# EAGLE schematic plantHAT (EAGLE 8.1.1)
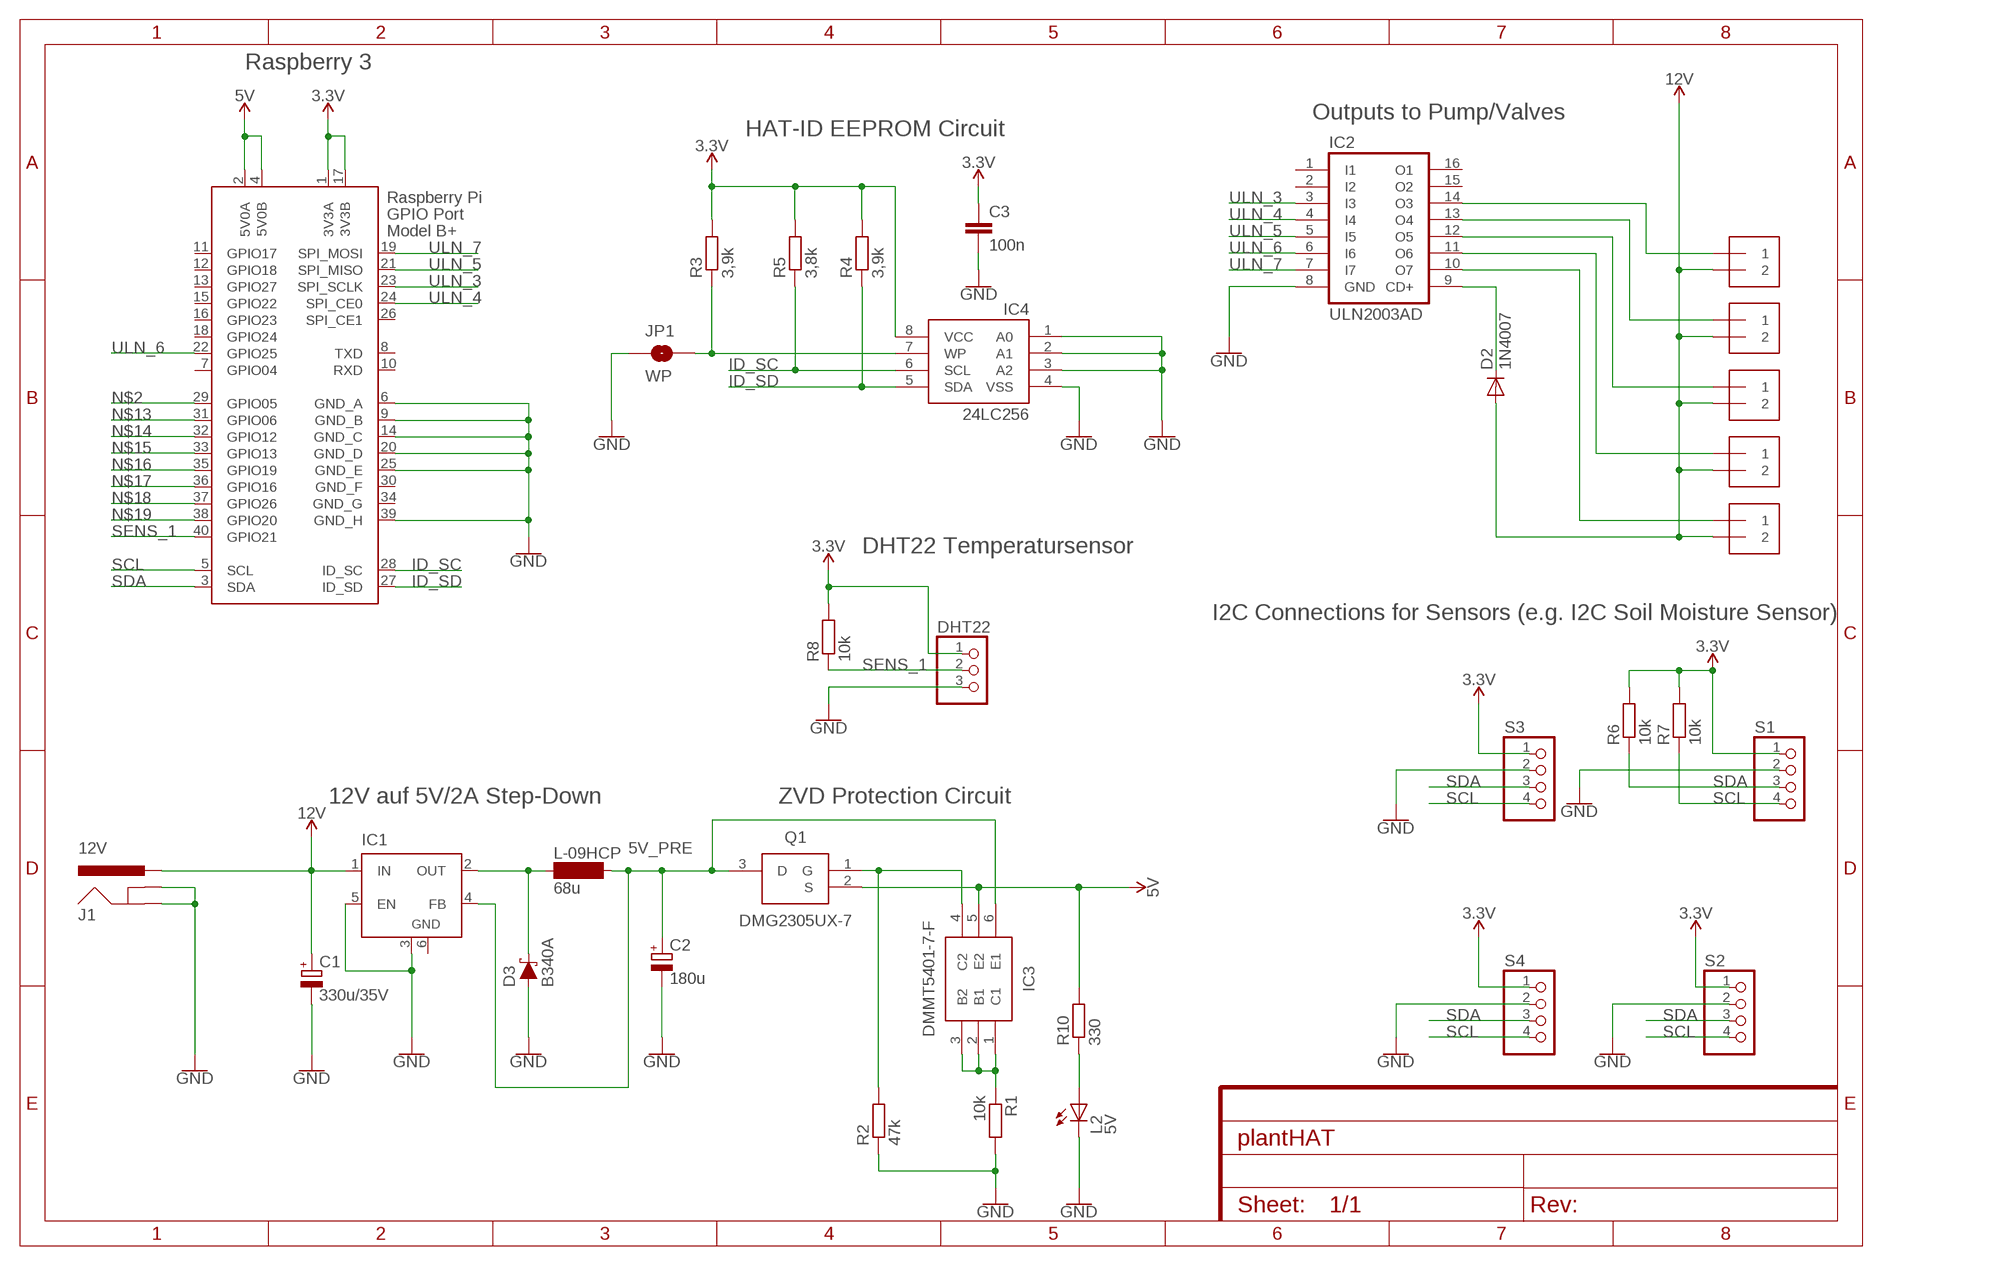
[diagram p0: schematic, sheet 1]
FRAME1 (FRAME-A4L): CNAME: plantHead Raspberry HAT; CREVISION: 1.0; DESIGNER: Patrick Laza

## Parts
C1  330u/35V  CPOL-EUE5-10.5  [E5-10,5]
C2  180u  CPOL-EUE5-10.5  [E5-10,5]
C3  100n  C-EU025-025X050  [C025-025X050]
D2  1N4007  1N4004  [DO41-10]
D3  B340A  DIODE-SCHOTTKY-B340A  [SMA-DIODE]
DHT22  PINHD-1X3  [1X03]
IC1  LM2596S  [TO263-5]
IC2  ULN2003AD  [SO16]
IC3  DMMT5401-7-F  [SOT95P275X110-6N]
IC4  24LC256  EEPROM-I2CSMD  [SO08]
J1  12V  POWER_JACK  [POWER_JACK_PTH]
J2  1X2-3.5MM  [1X2-3.5MM]
J3  1X2-3.5MM  [1X2-3.5MM]
J4  1X2-3.5MM  [1X2-3.5MM]
J5  1X2-3.5MM  [1X2-3.5MM]
J6  1X2-3.5MM  [1X2-3.5MM]
JP1  WP  JUMPER-SMT_2_NO_SILK  [SMT-JUMPER_2_NO_SILK]
L2  5V  LEDCHIP-LED0805  [CHIP-LED0805]
L-09HCP  68u  SD12-680  [SD12-680]
Q1  DMG2305UX-7  [SOT96P240X100-3N]
R1  10k  R-EU_R0805  [R0805]
R2  47k  R-EU_R0805  [R0805]
R3  3,9k  R-EU_R0805  [R0805]
R4  3,9k  R-EU_R0805  [R0805]
R5  3,8k  R-EU_R0805  [R0805]
R6  10k  R-EU_R0805  [R0805]
R7  10k  R-EU_R0805  [R0805]
R8  10k  R-EU_R0805  [R0805]
R10  330  R-EU_R0805  [R0805]
S1  PINHD-1X4  [1X04]
S2  PINHD-1X4  [1X04]
S3  PINHD-1X4  [1X04]
S4  PINHD-1X4  [1X04]
X2  RASPI_BOARD_B+#_HDC  [RASPI_BOARD_B+HAT_DF_CF]

## Nets
3.3V: C3.1 DHT22.1 IC4.8(VCC) R3.2 R4.2 R5.2 R6.2 R7.2 R8.2 S1.1 S2.1 S3.1 S4.1 X2.1(3V3A) X2.17(3V3B)
5V: IC3.5(E2) Q1.2(S) R10.2 X2.2(5V0A) X2.4(5V0B)
5V_PRE: C2.+ IC1.4(FB) IC3.6(E1) L-09HCP.2 Q1.3(D)
12V: C1.+ D2.A IC1.1(IN) J1.PWR J2.2 J3.2 J4.2 J5.2 J6.2
GND: C1.- C2.- C3.2 D3.A DHT22.3 IC1.3(GND) IC1.5(EN) IC2.8(GND) IC4.1(A0) IC4.2(A1) IC4.3(A2) IC4.4(VSS) J1.GND J1.GNDBREAK JP1.1 L2.C R1.2 R2.1 S1.2 S2.2 S3.2 S4.2 X2.6(GND_A) X2.9(GND_B) X2.14(GND_C) X2.20(GND_D) X2.25(GND_E) X2.39(GND_H)
ID_SC: IC4.6(SCL) R5.1 X2.28(ID_SC)
ID_SD: IC4.5(SDA) R4.1 X2.27(ID_SD)
N$1: D3.C IC1.2(OUT) L-09HCP.1
N$2: X2.29(GPIO05)
N$4: IC2.14(O3) J6.1
N$5: IC2.13(O4) J5.1
N$6: IC2.12(O5) J4.1
N$7: IC2.11(O6) J3.1
N$8: IC2.10(O7) J2.1
N$9: IC3.1(C1) IC3.2(B1) IC3.3(B2) R1.1
N$10: IC3.4(C2) Q1.1(G) R2.2
N$11: IC4.7(WP) JP1.2 R3.1
N$13: X2.31(GPIO06)
N$14: X2.32(GPIO12)
N$15: X2.33(GPIO13)
N$16: X2.35(GPIO19)
N$17: X2.36(GPIO16)
N$18: X2.37(GPIO26)
N$19: X2.38(GPIO20)
N$20: L2.A R10.1
N$21: D2.C IC2.9(CD+)
SCL: R7.1 S1.4 S2.4 S3.4 S4.4 X2.5(SCL)
SDA: R6.1 S1.3 S2.3 S3.3 S4.3 X2.3(SDA)
SENS_1: DHT22.2 R8.1 X2.40(GPIO21)
ULN_3: IC2.3(I3) X2.23(SPI_SCLK)
ULN_4: IC2.4(I4) X2.24(SPI_CE0)
ULN_5: IC2.5(I5) X2.21(SPI_MISO)
ULN_6: IC2.6(I6) X2.22(GPIO25)
ULN_7: IC2.7(I7) X2.19(SPI_MOSI)
Unconnected: IC2.1(I1) IC2.2(I2) IC2.15(O2) IC2.16(O1) X2.7(GPIO04) X2.8(TXD) X2.10(RXD) X2.11(GPIO17) X2.12(GPIO18) X2.13(GPIO27) X2.15(GPIO22) X2.16(GPIO23) X2.18(GPIO24) X2.26(SPI_CE1)

## Notes on the sheet
- Raspberry 3
- Outputs to Pump/Valves
- HAT-ID EEPROM Circuit
- DHT22 Temperatursensor
- I2C Connections for Sensors (e.g. I2C Soil Moisture Sensor)
- 12V auf 5V/2A Step-Down | ZVD Protection Circuit

## Power pins joined to a net without a drawn wire
GND: IC1.6(GND)
GND_F: X2.30(GND_F)
GND_G: X2.34(GND_G)

## Library data of the parts
C1 C2 = resistor:CPOL-EU: POLARIZED CAPACITOR, European symbol
C3 = resistor:C-EU: CAPACITOR, European symbol
D2 = diode:1N4004: DIODE general purpose rectifier, 1 A
D3 = SparkFun-DiscreteSemi:DIODE-SCHOTTKY: Schottky diode A Schottky diode is a semiconductor diode which has a low forward voltage drop and a very fast switching action.; PROD_ID: DIO-09886; VALUE: 3A/40V/500mV
DHT22 = pinhead:PINHD-1X3: PIN HEADER
IC1 = linear:LM2596S: STEP-DOWN VOLTAGE REGULATOR
IC2 = uln-udn:ULN2003A: DRIVER ARRAY
IC3 = plantHead:DMMT5401-7-F: Transistor Dual PNP 150V 0.2A SOT26-6 Diodes Inc DMMT5401-7-F Dual PNP Bipolar Transistor, -200 mA, -150 V, 6-Pin SOT-26 <https://componentsearchengine.com/Images/3/DMMT5401-7-F.jpg> Source: Datasheet <http://docs-europe.electrocomponents.com/webdocs/0e49/0900766b80e49504.pdf>; DESCRIPTION: Transistor Dual PNP 150V 0.2A SOT26-6 Diodes Inc DMMT5401-7-F Dual PNP Bipolar Transistor, -200 mA, -150 V, 6-Pin SOT-26; HEIGHT: 1.1mm; MANUFACTURER_NAME: Diodes Inc.; MANUFACTURER_PART_NUMBER: DMMT5401-7-F; RS_PART_NUMBER: 1220640; SUPPLIER_NAME: RS
IC4 = SparkFun-IC-Memory:EEPROM-I2C: I2C EEPROMs, 24LC256 and others 24LC256 Series 256 kb I2C 2 Wire (32 k x 8 Bit) 2.5 V Serial EEPROM SMD - SOIC-8 Datasheet SparkFun Products SparkFun UDB5 - PIC UAV Development Board <https://www.sparkfun.com/products/11703> (GPS-11703); PROD_ID: IC-09714
J1 = SparkFun-Connectors:POWER_JACK: Power Jack Connector This is the standard 5.5mm barrel jack for power. The PTH is the most common, proven, reliable, footprint. The Slot footprint only works if the mill layer is transmitted to the PCB fab house so be warned. Here are the connectors we sell at SparkFun: DC Barrel Power Jack/Connector <https://www.sparkfun.com/products/119> (PRT-00119) DC Barrel Power Jack/Connector (SMD) <https://www.sparkfun.com/products/12748> (PRT-12748) DC Barrel Jack Adapter - Breadboard Compatible <https://www.sparkfun.com/products/10811> (PRT-10811) It is used on this SparkFun product (and many, many others): SparkFun RedBoard - Programmed with Arduino <https://www.sparkfun.com/products/12757> (DEV-12757) Also, if you need a mating power supply or connector, please check these out: Wall Adapter Power Supply - 9VDC 650mA <https://www.sparkfun.com/products/298> (TOL-00298) DC Barrel Jack Adapter - Male <https://www.sparkfun.com/products/10287> (PRT-10287); PROD_ID: CONN-08197
J2-J6 = adafruit:1X2: 3.5mm Terminal block http://www.ladyada.net/library/pcb/eaglelibrary.html
JP1 = SparkFun-Jumpers:JUMPER-SMT_2_NO: Normally open jumper This jumper has two pads in close proximity to each other. Apply solder to close the connection. Round pads are easier to solder for beginners, but are a lot larger. SparkFun Product that uses the round pads: SparkFun EL Sequencer <https://www.sparkfun.com/products/12781>
L2 = adafruit:LED: LED OSRAM: - CHIPLED LG R971, LG N971, LY N971, LG Q971, LY Q971, LO R971, LY R971 LH N974, LH R974 LS Q976, LO Q976, LY Q976 LO Q996 - Hyper CHIPLED LW Q18S LB Q993, LB Q99A, LB R99A - SideLED LS A670, LO A670, LY A670, LG A670, LP A670 LB A673, LV A673, LT A673, LW A673 LH A674 LY A675 LS A676, LA A676, LO A676, LY A676, LW A676 LS A679, LY A679, LG A679 - Hyper Micro SIDELED® LS Y876, LA Y876, LO Y876, LY Y876 LT Y87S - SmartLED LW L88C, LW L88S LB L89C, LB L89S, LG L890 LS L89K, LO L89K, LY L89K LS L896, LA L896, LO L896, LY L896 - TOPLED LS T670, LO T670, LY T670, LG T670, LP T670 LSG T670, LSP T670, LSY T670, LOP T670, LYG T670 LG T671, LOG T671, LSG T671 LB T673, LV T673, LT T673, LW T673 LH T674 LS T676, LA T676, LO T676, LY T676, LB T676, LH T676, LSB T676, LW T676 LB T67C, LV T67C, LT T67C, LS T67K, LO T67K, LY T67K, LW E67C LS E67B, LA E67B, LO E67B, LY E67B, LB E67C, LV E67C, LT E67C LW T67C LS T679, LY T679, LG T679 LS T770, LO T770, LY T770, LG T770, LP T770 LB T773, LV T773, LT T773, LW T773 LH T774 LS E675, LA E675, LY E675, LS T675 LS T776, LA T776, LO T776, LY T776, LB T776 LHGB T686 LT T68C, LB T68C - Hyper Mini TOPLED® LB M676 - Mini TOPLED Santana® LG M470 LS M47K, LO M47K, LY M47K Source: http://www.osram.convergy.de/
L-09HCP = plantHead:SD12: INDUCTOR nominal inductance
Q1 = plantHead:DMG2305UX-7: MOSFET P-Ch 20V 5A Enhancement SOT23 Diodes Inc DMG2305UX-7 P-channel MOSFET Transistor, -3.3 A, -20 V, 3-Pin SOT-23 Source: Datasheet <http://www.diodes.com/_files/datasheets/DMG2305UX.pdf>; DESCRIPTION: MOSFET P-Ch 20V 5A Enhancement SOT23 Diodes Inc DMG2305UX-7 P-channel MOSFET Transistor, -3.3 A, -20 V, 3-Pin SOT-23; HEIGHT: 1mm; MANUFACTURER_NAME: Diodes Inc.; MANUFACTURER_PART_NUMBER: DMG2305UX-7; RS_PART_NUMBER: 8270452; SUPPLIER_NAME: RS
R1-R8 R10 = resistor:R-EU_: RESISTOR, European symbol
S1-S4 = pinhead:PINHD-1X4: PIN HEADER
X2 = Bastelstube_raspberry:RASPI_BOARD_B+#: Raspberry Pi GPIO connector with markings for the outer dimensions of the Raspberry Pi board model B+ with different sets of drill holes or mounting pads All pins connected